# Altium schematic sheet Sheet1.SchDoc
size A4; SheetNumber: 1; SheetTotal: 1
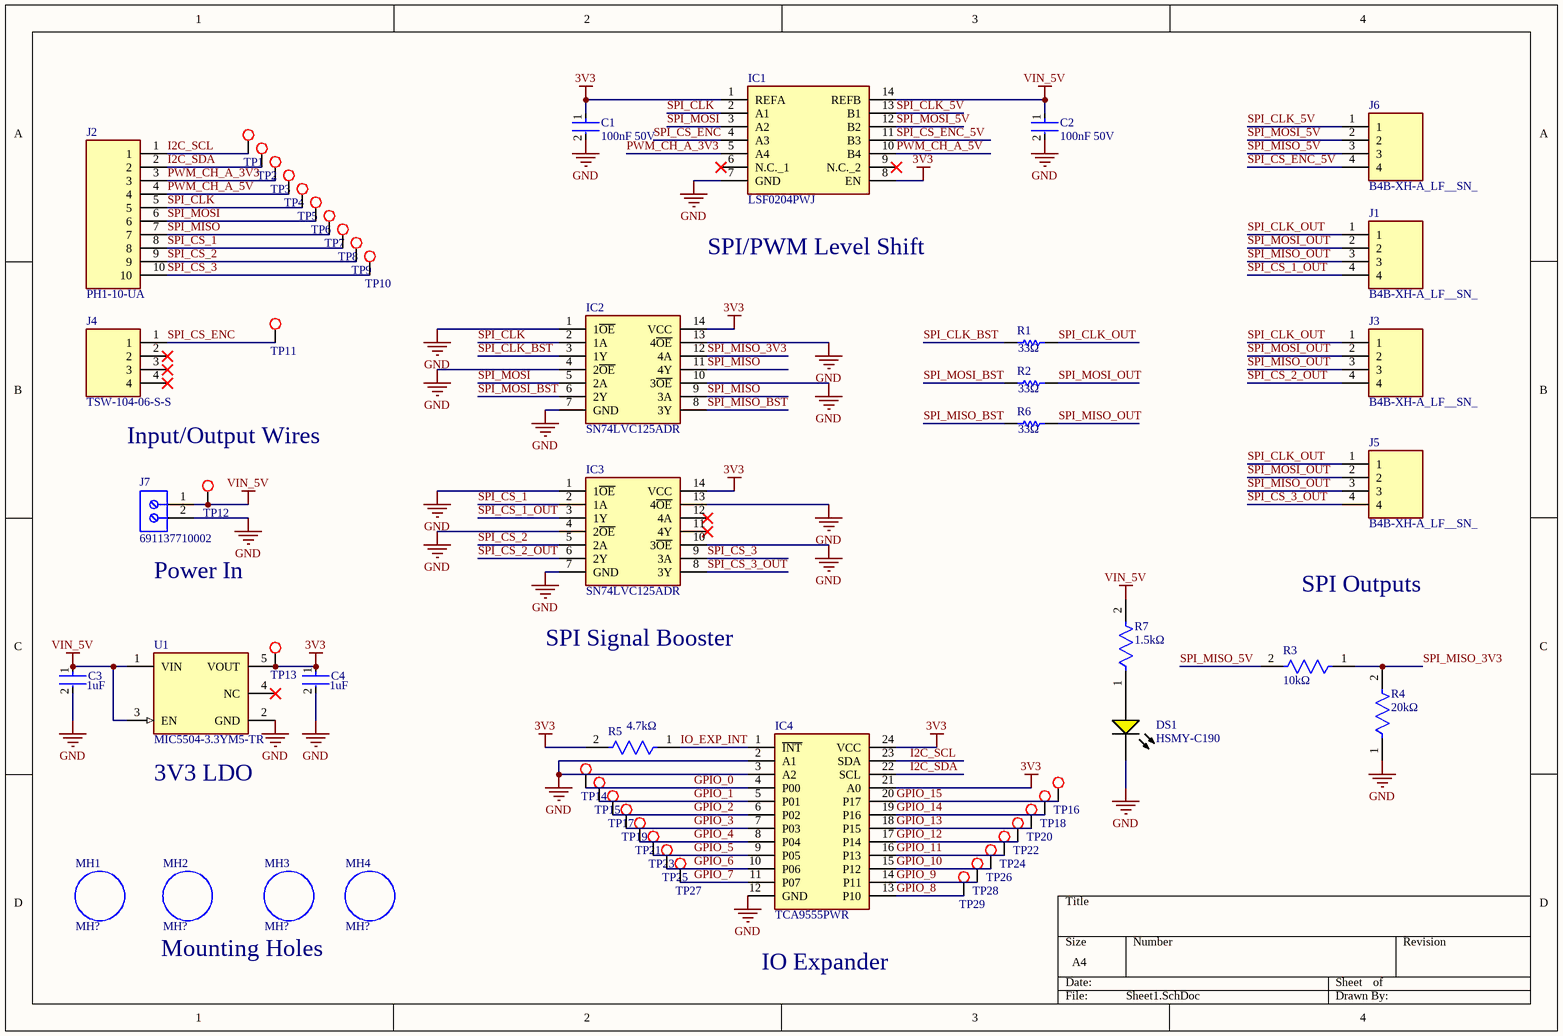
[diagram p0: Sheet1.SchDoc]

## Parts
C1  100nF 50V  [FP-CL31-IPC_C]
C2  100nF 50V  [FP-CL31-IPC_C]
C3  1uF  [FP-CL10-IPC_C]
C4  1uF  [FP-CL10-IPC_C]
DS1  HSMY-C190  [AVAG-HSMX-C190_V]
IC1  LSF0204PWJ  [SOP65P640X110-14N]
IC2  SN74LVC125ADR  [SOIC127P600X175-14N]
IC3  SN74LVC125ADR  [SOIC127P600X175-14N]
IC4  TCA9555PWR  [SOP65P640X120-24N]
J1  B4B-XH-A_LF__SN_  [B4BXHALFSN]
J2  PH1-10-UA  [HDRV10W64P0X254_1X10_2540X249X886P]
J3  B4B-XH-A_LF__SN_  [B4BXHALFSN]
J4  TSW-104-06-S-S  [TSW-104-XX-YY-S]
J5  B4B-XH-A_LF__SN_  [B4BXHALFSN]
J6  B4B-XH-A_LF__SN_  [B4BXHALFSN]
J7  691137710002  [691137710002]
MH1  MH?  [Mounting Hole]  (no BOM)
MH2  MH?  [Mounting Hole]  (no BOM)
MH3  MH?  [Mounting Hole]  (no BOM)
MH4  MH?  [Mounting Hole]  (no BOM)
R1  33Ω  [RESC1609X50X30NL10T20]
R2  33Ω  [RESC1609X50X30NL10T20]
R3  10kΩ  [FP-RT0603-MFG]
R4  20kΩ  [FP-RT0805-MFG]
R5  4.7kΩ  [FP-RT0805-MFG]
R6  33Ω  [RESC1609X50X30NL10T20]
R7  1.5kΩ  [FP-RC1608-IPC_B]
TP1  TP  [Testpoint]  (value not drawn)
TP2  TP  [Testpoint]  (value not drawn)
TP3  TP  [Testpoint]  (value not drawn)
TP4  TP  [Testpoint]  (value not drawn)
TP5  TP  [Testpoint]  (value not drawn)
TP6  TP  [Testpoint]  (value not drawn)
TP7  TP  [Testpoint]  (value not drawn)
TP8  TP  [Testpoint]  (value not drawn)
TP9  TP  [Testpoint]  (value not drawn)
TP10  TP  [Testpoint]  (value not drawn)
TP11  TP  [Testpoint]  (value not drawn)
TP12  TP  [Testpoint]  (value not drawn)
TP13  TP  [Testpoint]  (value not drawn)
TP14  TP  [Testpoint]  (value not drawn)
TP15  TP  [Testpoint]  (value not drawn)
TP16  TP  [Testpoint]  (value not drawn)
TP17  TP  [Testpoint]  (value not drawn)
TP18  TP  [Testpoint]  (value not drawn)
TP19  TP  [Testpoint]  (value not drawn)
TP20  TP  [Testpoint]  (value not drawn)
TP21  TP  [Testpoint]  (value not drawn)
TP22  TP  [Testpoint]  (value not drawn)
TP23  TP  [Testpoint]  (value not drawn)
TP24  TP  [Testpoint]  (value not drawn)
TP25  TP  [Testpoint]  (value not drawn)
TP26  TP  [Testpoint]  (value not drawn)
TP27  TP  [Testpoint]  (value not drawn)
TP28  TP  [Testpoint]  (value not drawn)
TP29  TP  [Testpoint]  (value not drawn)
U1  MIC5504-3.3YM5-TR  [FP-SOT23-5LD-PL-1-MFG]

## Nets
3V3: C1.1 C4.1 IC1.1(REFA) IC1.8(EN) IC2.14(VCC) IC3.14(VCC) IC4.21(A0) IC4.24(VCC) R5.2 TP13.0 U1.5(VOUT)
GND: C1.2 C2.2 C3.2 C4.2 DS1.2(K) IC1.7(GND) IC2.1(1~{OE}) IC2.4(2~{OE}) IC2.7(GND) IC2.10(3~{OE}) IC2.13(4~{OE}) IC3.1(1~{OE}) IC3.4(2~{OE}) IC3.7(GND) IC3.10(3~{OE}) IC3.13(4~{OE}) IC4.2(A1) IC4.3(A2) IC4.12(GND) J7.2 R4.1 U1.2(GND)
VIN_5V: C2.1 C3.1 IC1.14(REFB) J7.1 R7.2 TP12.0 U1.1(VIN) U1.3(EN)
GPIO_0: IC4.4(P00) TP14.0
GPIO_1: IC4.5(P01) TP15.0
GPIO_2: IC4.6(P02) TP17.0
GPIO_3: IC4.7(P03) TP19.0
GPIO_4: IC4.8(P04) TP21.0
GPIO_5: IC4.9(P05) TP23.0
GPIO_6: IC4.10(P06) TP25.0
GPIO_7: IC4.11(P07) TP27.0
GPIO_8: IC4.13(P10) TP29.0
GPIO_9: IC4.14(P11) TP28.0
GPIO_10: IC4.15(P12) TP26.0
GPIO_11: IC4.16(P13) TP24.0
GPIO_12: IC4.17(P14) TP22.0
GPIO_13: IC4.18(P15) TP20.0
GPIO_14: IC4.19(P16) TP18.0
GPIO_15: IC4.20(P17) TP16.0
I2C_SCL: IC4.23(SDA) J2.1 TP1.0
I2C_SDA: IC4.22(SCL) J2.2 TP2.0
IO_EXP_INT: IC4.1(~{INT}) R5.1
PWM_CH_A_3V3: IC1.5(A4) J2.3 TP3.0
PWM_CH_A_5V: IC1.10(B4) J2.4 TP4.0
SPI_CLK: IC1.2(A1) IC2.2(1A) J2.5 TP5.0
SPI_CLK_5V: IC1.13(B1) J6.1
SPI_CLK_BST: IC2.3(1Y) R1.1
SPI_CLK_OUT: J1.1 J3.1 J5.1 R1.2
SPI_CS_1: IC3.2(1A) J2.8 TP8.0
SPI_CS_1_OUT: IC3.3(1Y) J1.4
SPI_CS_2: IC3.5(2A) J2.9 TP9.0
SPI_CS_2_OUT: IC3.6(2Y) J3.4
SPI_CS_3: IC3.9(3A) J2.10 TP10.0
SPI_CS_3_OUT: IC3.8(3Y) J5.4
SPI_CS_ENC: IC1.4(A3) J4.1 TP11.0
SPI_CS_ENC_5V: IC1.11(B3) J6.4
SPI_MISO: IC2.9(3A) IC2.11(4Y) J2.7 TP7.0
SPI_MISO_3V3: IC2.12(4A) R3.1 R4.2
SPI_MISO_5V: J6.3 R3.2
SPI_MISO_BST: IC2.8(3Y) R6.1
SPI_MISO_OUT: J1.3 J3.3 J5.3 R6.2
SPI_MOSI: IC1.3(A2) IC2.5(2A) J2.6 TP6.0
SPI_MOSI_5V: IC1.12(B2) J6.2
SPI_MOSI_BST: IC2.6(2Y) R2.1
SPI_MOSI_OUT: J1.2 J3.2 J5.2 R2.2
NetDS1_1: DS1.1(A) R7.1

Not connected (* = marked no-connect by the designer): IC1 6(N.C._1)* 9(N.C._2)*; IC3 11(4Y)* 12(4A)*; J4 2* 3* 4*; U1 4(NC)*

## Notes on the sheet
- SPI/PWM Level Shift
- Input/Output Wires
- (near J7) Power In
- SPI Signal Booster
- SPI Outputs
- (near U1) 3V3 LDO
- Mounting Holes
- IO Expander

## Library data of the parts
C1 C2 = CMP-13271-001276-1: Cap Ceramic 100nF 50V X7R ±10% SMD 1206 +125°C Embossed T/R; Dielectric: X7R; Case Code (Metric): 3216; Package Quantity: 1; Thickness: 0.037inch; Depth: 1.6mm; Packaging: Tape and Reel; Capacitance: 100nF; Length: 0.126inch; Tolerance: 10%; Voltage Rating: 50V; Case Code (Imperial): 1206; Radiation Hardening: No; Width: 0.063inch; Case/Package: 1206; Max Operating Temperature: 125°C; Min Operating Temperature: -55°C; Height: 0.85mm; Mount: Surface Mount
C3 C4 = CMP-13271-003399-1: Cap Ceramic 1uF 10V X5R ±10% Pad SMD 0603 +85°C T/R; Min Operating Temperature: -55°C; Max Operating Temperature: 85°C; Dielectric: X5R; Contact Plating: Tin; Height: 0.8mm; Voltage: 10V; Packaging: Tape and Reel; Voltage Rating: 10V; Capacitance: 1uF; Package Quantity: 1; Width: 0.031inch; Length: 1.6mm; Depth: 0.8mm; Case/Package: 0603; Case Code (Imperial): 0603; Thickness: 0.035inch; Radiation Hardening: No; Tolerance: 10%; Case Code (Metric): 1608; Mount: Surface Mount
DS1 = CMP-1744-00003-1: LED Uni-Color Yellow, 65 mW, 20 mA, -40 to 85 degC, 2-Pin SMD, RoHS, Tape and Reel; Tolerance: 1%; Voltage Rating: 50 V; Power Rating: 100 mW; Case\Package: 0603; Resistance: 390 Ohm; Min Operating Temperature: -55 degC; Length: 1.6 mm; ComponentLink3Description: Package Specification; Mount: Surface Mount; PackageReference: HSMX-C190; ComponentLink2Description: Datasheet; DatasheetVersion: Mar-12; Case Code (Metric): 1608; Pins: 2; Package Quantity: 5000; ComponentLink2URL: http://docs.avagotech.com/docs/AV02-0551EN; ComponentLink1Description: Manufacturer URL; RoHSCompliant: true; Packaging: Tape and Reel; PackageDescription: 2-Pin Surface Mount Device, Body 1.6 x 0.8 mm, Height 0.9 mm; REACH SVHC: No SVHC; ComponentLink3URL: http://www.fairchildsemi.com/dwg/MA/MA03D.pdf; Voltage Rating (DC): 50 V; Width: 0.8 mm; ComponentLink1URL: http://www.avagotech.com/; Max Operating Temperature: 155 degC; Case Code (Imperial): 0603; Height: 0.45 mm
IC1 = LSF0204PWJ: Integrated Circuit; Manufacturer_Name: Nexperia; Datasheet Link: https://assets.nexperia.com/documents/data-sheet/LSF0204.pdf; Height: 1.1mm; Manufacturer_Part_Number: LSF0204PWJ; Mouser Part Number: 771-LSF0204PWJ; Mouser Price/Stock: https://www.mouser.co.uk/ProductDetail/Nexperia/LSF0204PWJ?qs=sPbYRqrBIVlVSmmo7LgSzQ%3D%3D; Arrow Part Number: LSF0204PWJ; Arrow Price/Stock: null?region=nac
IC2 IC3 = SN74LVC125ADR: Integrated Circuit; Manufacturer_Name: Texas Instruments; Datasheet Link: http://www.ti.com/lit/gpn/sn74lvc125a; Height: 1.75mm; Manufacturer_Part_Number: SN74LVC125ADR; Mouser Part Number: 595-SN74LVC125ADR; Mouser Price/Stock: https://www.mouser.co.uk/ProductDetail/Texas-Instruments/SN74LVC125ADR?qs=rgxfVHSNRPX26uoxCHh71w%3D%3D; Arrow Part Number: SN74LVC125ADR; Arrow Price/Stock: https://www.arrow.com/en/products/sn74lvc125adr/texas-instruments?utm_currency=USD&region=nac
IC4 = TCA9555PWR: Integrated Circuit; Manufacturer_Name: Texas Instruments; Datasheet Link: https://www.ti.com/lit/gpn/TCA9555; Height: 1.2mm; Manufacturer_Part_Number: TCA9555PWR; Mouser Part Number: 595-TCA9555PWR; Mouser Price/Stock: https://www.mouser.co.uk/ProductDetail/Texas-Instruments/TCA9555PWR?qs=O3wcJz4o8IeDwg4St4nEYQ%3D%3D; Arrow Part Number: TCA9555PWR; Arrow Price/Stock: https://www.arrow.com/en/products/tca9555pwr/texas-instruments?region=nac
J1 J3 J5 J6 = B4B-XH-A_LF__SN_: Connector; Manufacturer_Name: JST (JAPAN SOLDERLESS TERMINALS); Manufacturer_Part_Number: B4B-XH-A(LF)(SN); Datasheet Link: https://datasheet.lcsc.com/szlcsc/JST-Sales-America-B4B-XH-A-LF-SN_C144395.pdf; Height: 7mm; Mouser Part Number: 306-B4BXHALFSN; Mouser Price/Stock: https://www.mouser.co.uk/ProductDetail/JST-Commercial/B4B-XH-ALFSN?qs=cdbOS8ANM9CfC08d%252BywhFw%3D%3D; Arrow Part Number: B4B-XH-A(LF)(SN); Arrow Price/Stock: https://www.arrow.com/en/products/b4b-xh-a-lf-sn/jst-manufacturing?utm_currency=USD&region=europe
J2 = PH1-10-UA: Connector; Manufacturer_Name: Adam Tech; Datasheet Link: https://app.adam-tech.com/products/download/data_sheet/201605/ph1-xx-ua-data-sheet.pdf; Height: 8.865mm; Manufacturer_Part_Number: PH1-10-UA; Mouser Part Number: 737-PH1-10-UA; Mouser Price/Stock: https://www.mouser.co.uk/ProductDetail/Adam-Tech/PH1-10-UA?qs=ogqIPVdloe%252Bff9mnAAAy9w%3D%3D; Arrow Part Number: PH1-10-UA; Arrow Price/Stock: null?utm_currency=USD&region=nac
J4 = TSW-104-06-S-S: Connector; Manufacturer_Name: SAMTEC; Datasheet Link: http://suddendocs.samtec.com/prints/tsw-xxx-xx-xxx-x-xx-xxx-mkt.pdf; Manufacturer_Part_Number: TSW-104-06-S-S
J7 = CMP-1502-03324-2: NexarPartId: 78871135; Voltage Rating: 300V; Number of Contacts: 2; Current Rating: 16A; Lead Pitch: 5mm; Height: 11.6mm; Packaging: Box; RoHS: Non-Compliant; Contact Material: Nickel, Tin; Max Operating Temperature: 120°C; Number of Pins: 2; Min Operating Temperature: -30°C; Number of Rows: 1
MH1-MH4 = Mounting Hole
R1 R2 R6 = CMP-2000-03252-1: Manufacturer: Vishay Dale; Part Number: CRCW060333R0JNTA
R3 = CMP-2000-04517-2: RES SMD 10K OHM 0.1% 1/10W 0603; Manufacturer Part Number: RT0603BRE0710KL; Manufacturer: Yageo; Tolerance: 0.001; Temperature Coefficient: 50 ppm/°C; Power Rating: 0.1W; Voltage Rating: 75V; Temperature Range High: +155°C; Device Class L2: Resistors; Temperature: -55°C to +155°C; Series: RT; Device Class L1: Passive Components; Temperature Range Low: -55°C; Automotive: No; Mouser Description: Res Thin Film 0603 10K Ohm 0.1% 1/10W ±50ppm/°C Molded SMD SMD Paper T/R; Device Class L3: Chip SMD Resistors; RoHS: TRUE; Package: RT0603; Footprint Url: http://www.yageo.com/exep/pages/download/literatures/PYu-R_Mount_10.pdf; Octopart: https://octopart.com/rt0603bre0710kl-yageo-1273959; ComponentLink2URL: http://www.yageo.com/documents/recent/PYu-RT_1-to-0.01_RoHS_L_9.pdf; Composition: Thin Film; Category: Res; Lead Free: Yes; Resistance: 10KΩ; Height: 0.55mm; Digikey Description: RES SMD 10K OHM 0.1% 1/10W 0603; Ipc Land Pattern Name: RESC16080X45; Value: 10KΩ; ComponentLink2Description: Datasheet
R4 = CMP-2001-01463-2: RES SMD 20K OHM 1% 1/8W 0805; Manufacturer: Yageo; Manufacturer Part Number: RT0805FRE0720KL; Power Rating: 0.125W; Voltage Rating: 150V; Tolerance: 0.0001; Temperature Coefficient: 50 ppm/°C; Height: 0.6mm; Lead Free: Yes; Device Class L3: Chip SMD Resistors; Series: RT; ComponentLink2URL: http://www.yageo.com/documents/recent/PYu-RT_1-to-0.01_RoHS_L_9.pdf; Footprint Url: http://www.yageo.com/exep/pages/download/literatures/PYu-R_Mount_10.pdf; Value: 20KΩ; Mouser Description: Thin Film Resistors - SMD 1/8W 20K ohm 1% 50ppm; Device Class L2: Resistors; Device Class L1: Passive Components; RoHS: TRUE; ComponentLink2Description: Datasheet; Category: Res; Package: RT0805; Digikey Description: RES SMD 20K OHM 1% 1/8W 0805; Temperature Range High: +155°C; Ipc Land Pattern Name: RESC200125X50; Temperature Range Low: -55°C; Octopart: https://octopart.com/rt0805fre0720kl-yageo-1410620; Resistance: 20KΩ; Temperature: -55°C to +155°C; Composition: Thin Film; Automotive: No
R5 = CMP-03412-019393-1: RES SMD 4.7K OHM 1% 1/8W 0805; Manufacturer Part Number: RT0805FRE074K7L; Manufacturer: Yageo; Tolerance: 0.0001; Power Rating: 0.125W; Voltage Rating: 150V; Temperature Coefficient: 50 ppm/°C; Device Class L1: Passive Components; Category: Res; Temperature Range Low: -55°C; Device Class L2: Resistors; Ipc Land Pattern Name: RESC200125X50; Package: RT0805; Device Class L3: Chip SMD Resistors; Temperature: -55°C to +155°C; ComponentLink2Description: Datasheet; Footprint Url: http://www.yageo.com/exep/pages/download/literatures/PYu-R_Mount_10.pdf; Series: RT; Mouser Description: Thin Film Resistors - SMD 1/8W 4.7K ohm 1% 50ppm; Height: 0.6mm; Resistance: 4.7KΩ; Octopart: https://octopart.com/rt0805fre074k7l-yageo-40047233; Value: 4.7KΩ; Digikey Description: RES SMD 4.7K OHM 1% 1/8W 0805; Composition: Thin Film; Automotive: No; Temperature Range High: +155°C; Lead Free: Yes; ComponentLink2URL: http://www.yageo.com/documents/recent/PYu-RT_1-to-0.01_RoHS_L_9.pdf; RoHS: TRUE
R7 = CMP-13261-004935-1: Res Thick Film 0603 1.5kΩ 1% 0.1W ±100ppm/°C Molded SMD T/R; Resistance: 1.5kR; Voltage Rating (DC): 50V; Power Rating: 100mW; Contact Plating: Tin; Depth: 0.8mm; Width: 800um; Tolerance: 1%; Lead Free: Lead Free; Composition: Thick Film; Military Standard: Not; Temperature Coefficient: 100ppm/°C; Radiation Hardening: No; Length: 1.6mm; Case/Package: 0603; Max Operating Temperature: 155°C; Packaging: Tape and Reel; Min Operating Temperature: -55°C
TP1-TP29 = Testpoint
U1 = CMP-2000-07604-2: IC REG LINEAR 3.3V 300MA SOT23-5; Quiescent Current: 38uA; Operating Supply Current: 42uA; Max Input Voltage: 5.5V; Min Input Voltage: 2.5V; Output Type: Fixed; Power Supply Rejection Ratio (PSRR): 60dB; Dropout Voltage: 380mV; Accuracy: 3%; Number of Outputs: 1; Nominal Output Voltage: 3.3V; Max Output Current: 300mA; Length: 2.9mm; Mount: Surface Mount; Width: 1.6mm; Packaging: Tape and Reel; Output Current: 300mA; Min Operating Temperature: -40°C; Max Operating Temperature: 125°C; Height: 1.1mm; Case/Package: SOT-23-5; REACH SVHC: No SVHC; Number of Pins: 5; Output Voltage: 3.3V